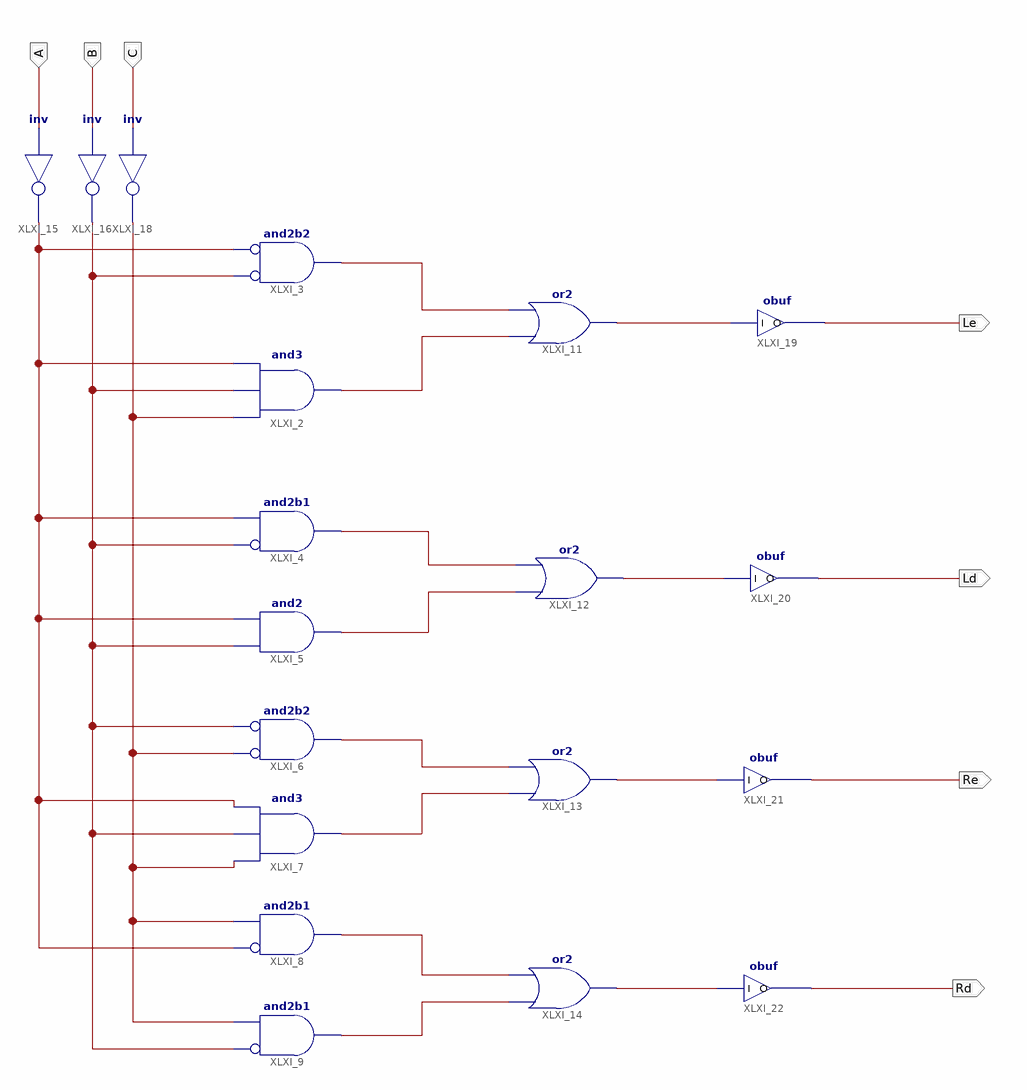
[diagram p0: schematic sheet 1]
// Xilinx ISE schematic section3_schematic.sch (xc9500xl) as structural Verilog: 19 symbols, 7 ports
module section3_schematic (
  input  A,
  input  B,
  input  C,
  output Le,
  output Ld,
  output Re,
  output Rd
);

  wire XLXN_3, XLXN_4, XLXN_6, XLXN_7, XLXN_8, XLXN_9, XLXN_10, XLXN_11, XLXN_27, XLXN_28, XLXN_30, XLXN_31,
       XLXN_32, XLXN_33, XLXN_34;

  and XLXI_2 (XLXN_4, XLXN_30, XLXN_28, XLXN_27);
  and XLXI_3 (XLXN_3, ~XLXN_28, ~XLXN_27);  // and2b2
  and XLXI_4 (XLXN_7, ~XLXN_28, XLXN_27);  // and2b1
  and XLXI_5 (XLXN_6, XLXN_28, XLXN_27);
  and XLXI_6 (XLXN_8, ~XLXN_30, ~XLXN_28);  // and2b2
  and XLXI_7 (XLXN_9, XLXN_30, XLXN_28, XLXN_27);
  and XLXI_8 (XLXN_10, ~XLXN_27, XLXN_30);  // and2b1
  and XLXI_9 (XLXN_11, ~XLXN_28, XLXN_30);  // and2b1
  or XLXI_11 (XLXN_31, XLXN_4, XLXN_3);
  or XLXI_12 (XLXN_32, XLXN_6, XLXN_7);
  or XLXI_13 (XLXN_33, XLXN_9, XLXN_8);
  or XLXI_14 (XLXN_34, XLXN_11, XLXN_10);
  not XLXI_15 (XLXN_27, A);
  not XLXI_16 (XLXN_28, B);
  not XLXI_18 (XLXN_30, C);
  obuf XLXI_19 (.I(XLXN_31), .O(Le));
  obuf XLXI_20 (.I(XLXN_32), .O(Ld));
  obuf XLXI_21 (.I(XLXN_33), .O(Re));
  obuf XLXI_22 (.I(XLXN_34), .O(Rd));
endmodule
